# EAGLE design arduino-shield-xyz-stepper-v3 (EAGLE 8.7.1)
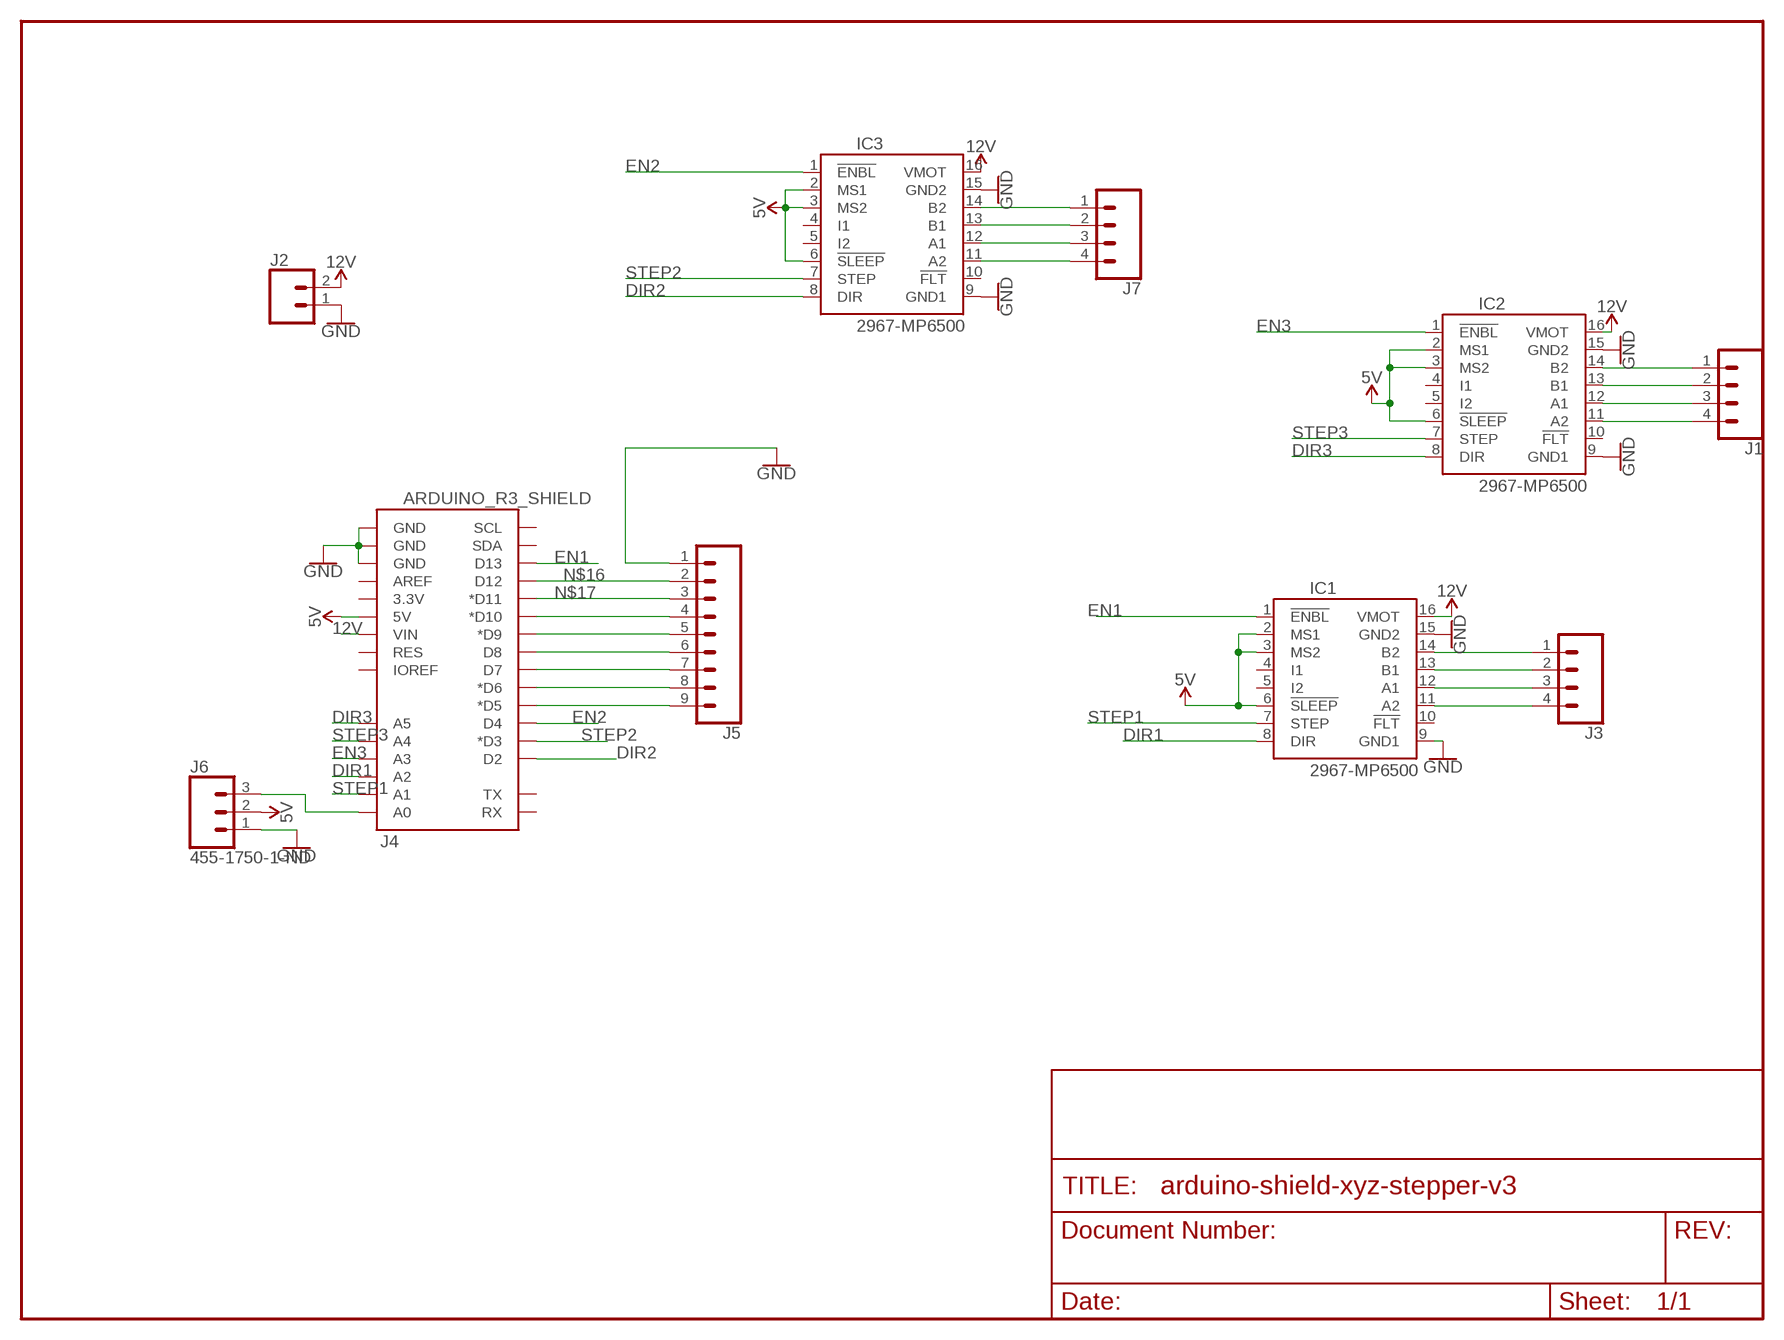
[diagram p0: schematic, sheet 1]

## Parts
IC1  2967-MP6500  [MP6500]
IC2  2967-MP6500  [MP6500]
IC3  2967-MP6500  [MP6500]
J1  CONN_04  [1X04]
J2  CONN_02  [1X02]
J3  CONN_04  [1X04]
J4  ARDUINO_R3_SHIELD  [UNO_R3_SHIELD]
J5  CONN_09  [1X09]
J6  455-1750-1-ND  CONN_03  [1X03]
J7  CONN_04  [1X04]

## Nets
5V: IC1.2(MS1) IC1.3(MS2) IC1.6(!SLEEP) IC2.2(MS1) IC2.3(MS2) IC2.6(!SLEEP) IC3.2(MS1) IC3.3(MS2) IC3.6(!SLEEP) J4.5V J6.2
12V: IC1.16(VMOT) IC2.16(VMOT) IC3.16(VMOT) J2.2 J4.VIN
DIR1: IC1.8(DIR) J4.A2
DIR2: IC3.8(DIR) J4.D2
DIR3: IC2.8(DIR) J4.A5
EN1: IC1.1(!ENBL) J4.D13
EN2: IC3.1(!ENBL) J4.D4
EN3: IC2.1(!ENBL) J4.A3
GND [vcc]: IC1.9(GND1) IC1.15(GND2) IC2.9(GND1) IC2.15(GND2) IC3.9(GND1) IC3.15(GND2) J2.1 J4.GND@0(GND) J4.GND@1(GND) J4.GND@2(GND) J5.1 J6.1
N$1: IC3.14(B2) J7.1
N$4: IC3.13(B1) J7.2
N$5: IC1.14(B2) J3.1
N$6: IC1.13(B1) J3.2
N$7: IC1.12(A1) J3.3
N$8: IC1.11(A2) J3.4
N$9: IC2.14(B2) J1.1
N$10: IC2.13(B1) J1.2
N$11: IC2.12(A1) J1.3
N$12: IC2.11(A2) J1.4
N$13: IC3.12(A1) J7.3
N$14: IC3.11(A2) J7.4
N$15: J4.A0 J6.3
N$16: J4.D12 J5.2
N$17: J4.D11(*D11) J5.3
N$18: J4.D10(*D10) J5.4
N$19: J4.D9(*D9) J5.5
N$22: J4.D8 J5.6
N$23: J4.D7 J5.7
N$24: J4.D6(*D6) J5.8
N$25: J4.D5(*D5) J5.9
STEP1: IC1.7(STEP) J4.A1
STEP2: IC3.7(STEP) J4.D3(*D3)
STEP3: IC2.7(STEP) J4.A4
Unconnected: IC1.4(I1) IC1.5(I2) IC1.10(!FLT) IC2.4(I1) IC2.5(I2) IC2.10(!FLT) IC3.4(I1) IC3.5(I2) IC3.10(!FLT) J4.3.3V J4.AREF J4.IOREF J4.RES J4.RX J4.SCL J4.SDA J4.TX

## Library data of the parts
IC1-IC3 = pololu-stepper-driver:2967-MP6500: MP6500 Stepper Motor Driver Carrier; Potentiometer Current Control (Header Pins Soldered) #2967 MP6500 Stepper Motor Driver Carrier; Potentiometer Current Control (Header Pins Soldered) <https://www.pololu.com/product/2967> in Japan, Suzaku Lab. Ltd. <https://suzakugiken.jp/> #2967 MP6500ステッピングモータドライバボード ポテンショメータ式電流制御 (ヘッダーピン実装済み) <https://szc.jp/po2967>
J1 J3 J7 = SparkFun-Connectors:CONN_04: Multi connection point. Often used as Generic Header-pin footprint for 0.1 inch spaced/style header connections On any of the 0.1 inch spaced packages, you can populate with these: Break Away Headers - Straight <https://www.sparkfun.com/products/116> (PRT-00116) Break Away Male Headers - Right Angle <https://www.sparkfun.com/products/553> (PRT-00553) Female Headers <https://www.sparkfun.com/products/115> (PRT-00115) Break Away Headers - Machine Pin <https://www.sparkfun.com/products/117> (PRT-00117) Break Away Female Headers - Swiss Machine Pin <https://www.sparkfun.com/products/743> (PRT-00743) For SCREWTERMINALS and SPRING TERMINALS visit here: Screw Terimnals on SparkFun.com <https://www.sparkfun.com/search/results?term=Screw+Terminals> (5mm/3.5mm/2.54mm spacing) This device is also useful as a general connection point to wire up your design to another part of your project. Our various solder wires solder well into these plated through hole pads. Hook-Up Wire - Assortment (Stranded, 22 AWG) <https://www.sparkfun.com/products/11375> (PRT-11375) Hook-Up Wire - Assortment (Solid Core, 22 AWG) <https://www.sparkfun.com/products/11367> (PRT-11367) View the entire wire category on our website here <https://www.sparkfun.com/categories/141> Special notes: Molex polarized connector foot print use with SKU : PRT-08231 with associated crimp pins and housings. 1MM SMD Version SKU: PRT-10208; PROD_ID: CONN-09696
J2 = SparkFun-Connectors:CONN_02: Multi connection point. Often used as Generic Header-pin footprint for 0.1 inch spaced/style header connections On any of the 0.1 inch spaced packages, you can populate with these: Break Away Headers - Straight <https://www.sparkfun.com/products/116> (PRT-00116) Break Away Male Headers - Right Angle <https://www.sparkfun.com/products/553> (PRT-00553) Female Headers <https://www.sparkfun.com/products/115> (PRT-00115) Break Away Headers - Machine Pin <https://www.sparkfun.com/products/117> (PRT-00117) Break Away Female Headers - Swiss Machine Pin <https://www.sparkfun.com/products/743> (PRT-00743) For SCREWTERMINALS and SPRING TERMINALS visit here: Screw Terimnals on SparkFun.com <https://www.sparkfun.com/search/results?term=Screw+Terminals> (5mm/3.5mm/2.54mm spacing) This device is also useful as a general connection point to wire up your design to another part of your project. Our various solder wires solder well into these plated through hole pads. Hook-Up Wire - Assortment (Stranded, 22 AWG) <https://www.sparkfun.com/products/11375> (PRT-11375) Hook-Up Wire - Assortment (Solid Core, 22 AWG) <https://www.sparkfun.com/products/11367> (PRT-11367) View the entire wire category on our website here <https://www.sparkfun.com/categories/141> Special notes: Molex polarized connector foot print use with: PRT-08233 with associated crimp pins and housings. 2.54_SCREWTERM for use with PRT-10571. 3.5mm Screw Terminal footprints for PRT-08084 5mm Screw Terminal footprints for use with PRT-08432
J4 = SparkFun-Boards:ARDUINO_R3_SHIELD: Shield form compatible with the Arduino Uno R3.
J5 = SparkFun-Connectors:CONN_09: Multi connection point. Often used as Generic Header-pin footprint for 0.1 inch spaced/style header connections On any of the 0.1 inch spaced packages, you can populate with these: Break Away Headers - Straight <https://www.sparkfun.com/products/116> (PRT-00116) Break Away Male Headers - Right Angle <https://www.sparkfun.com/products/553> (PRT-00553) Female Headers <https://www.sparkfun.com/products/115> (PRT-00115) Break Away Headers - Machine Pin <https://www.sparkfun.com/products/117> (PRT-00117) Break Away Female Headers - Swiss Machine Pin <https://www.sparkfun.com/products/743> (PRT-00743) For SCREWTERMINALS and SPRING TERMINALS visit here: Screw Terimnals on SparkFun.com <https://www.sparkfun.com/search/results?term=Screw+Terminals> (5mm/3.5mm/2.54mm spacing) This device is also useful as a general connection point to wire up your design to another part of your project. Our various solder wires solder well into these plated through hole pads. Hook-Up Wire - Assortment (Stranded, 22 AWG) <https://www.sparkfun.com/products/11375> (PRT-11375) Hook-Up Wire - Assortment (Solid Core, 22 AWG) <https://www.sparkfun.com/products/11367> (PRT-11367) View the entire wire category on our website here <https://www.sparkfun.com/categories/141> Special notes: Molex polarized connector foot print use with SKU : PRT-08231 with associated crimp pins and housings. 1MM SMD Version SKU: PRT-10208 NOTES ON THE VARIANTS LOCK and LOCK_LONGPADS... This footprint was designed to help hold the alignment of a through-hole component (i.e. 6-pin header) while soldering it into place. You may notice that each hole has been shifted either up or down by 0.005 of an inch from it's more standard position (which is a perfectly straight line). This slight alteration caused the pins (the squares in the middle) to touch the edges of the holes. Because they are alternating, it causes a "brace" to hold the component in place. 0.005 has proven to be the perfect amount of "off-center" position when using our standard breakaway headers. Although looks a little odd when you look at the bare footprint, once you have a header in there, the alteration is very hard to notice. Also,if you push a header all the way into place, it is covered up entirely on the bottom side.
J6 = SparkFun-Connectors:CONN_03: Multi connection point. Often used as Generic Header-pin footprint for 0.1 inch spaced/style header connections On any of the 0.1 inch spaced packages, you can populate with these: Break Away Headers - Straight <https://www.sparkfun.com/products/116> (PRT-00116) Break Away Male Headers - Right Angle <https://www.sparkfun.com/products/553> (PRT-00553) Female Headers <https://www.sparkfun.com/products/115> (PRT-00115) Break Away Headers - Machine Pin <https://www.sparkfun.com/products/117> (PRT-00117) Break Away Female Headers - Swiss Machine Pin <https://www.sparkfun.com/products/743> (PRT-00743) Stackable Header - 3 Pin (Female, 0.1") <https://www.sparkfun.com/products/13875> (PRT-13875) For SCREWTERMINALS and SPRING TERMINALS visit here: Screw Terimnals on SparkFun.com <https://www.sparkfun.com/search/results?term=Screw+Terminals> (5mm/3.5mm/2.54mm spacing) This device is also useful as a general connection point to wire up your design to another part of your project. Our various solder wires solder well into these plated through hole pads. Hook-Up Wire - Assortment (Stranded, 22 AWG) <https://www.sparkfun.com/products/11375> (PRT-11375) Hook-Up Wire - Assortment (Solid Core, 22 AWG) <https://www.sparkfun.com/products/11367> (PRT-11367) View the entire wire category on our website here <https://www.sparkfun.com/categories/141> Special notes: Molex polarized connector foot print use with SKU : PRT-08232 with associated crimp pins and housings.; PROD_ID: XXX-00000

## Net classes
0 Default: width 0.178 mm
1 vcc: width 0.178 mm

## Board
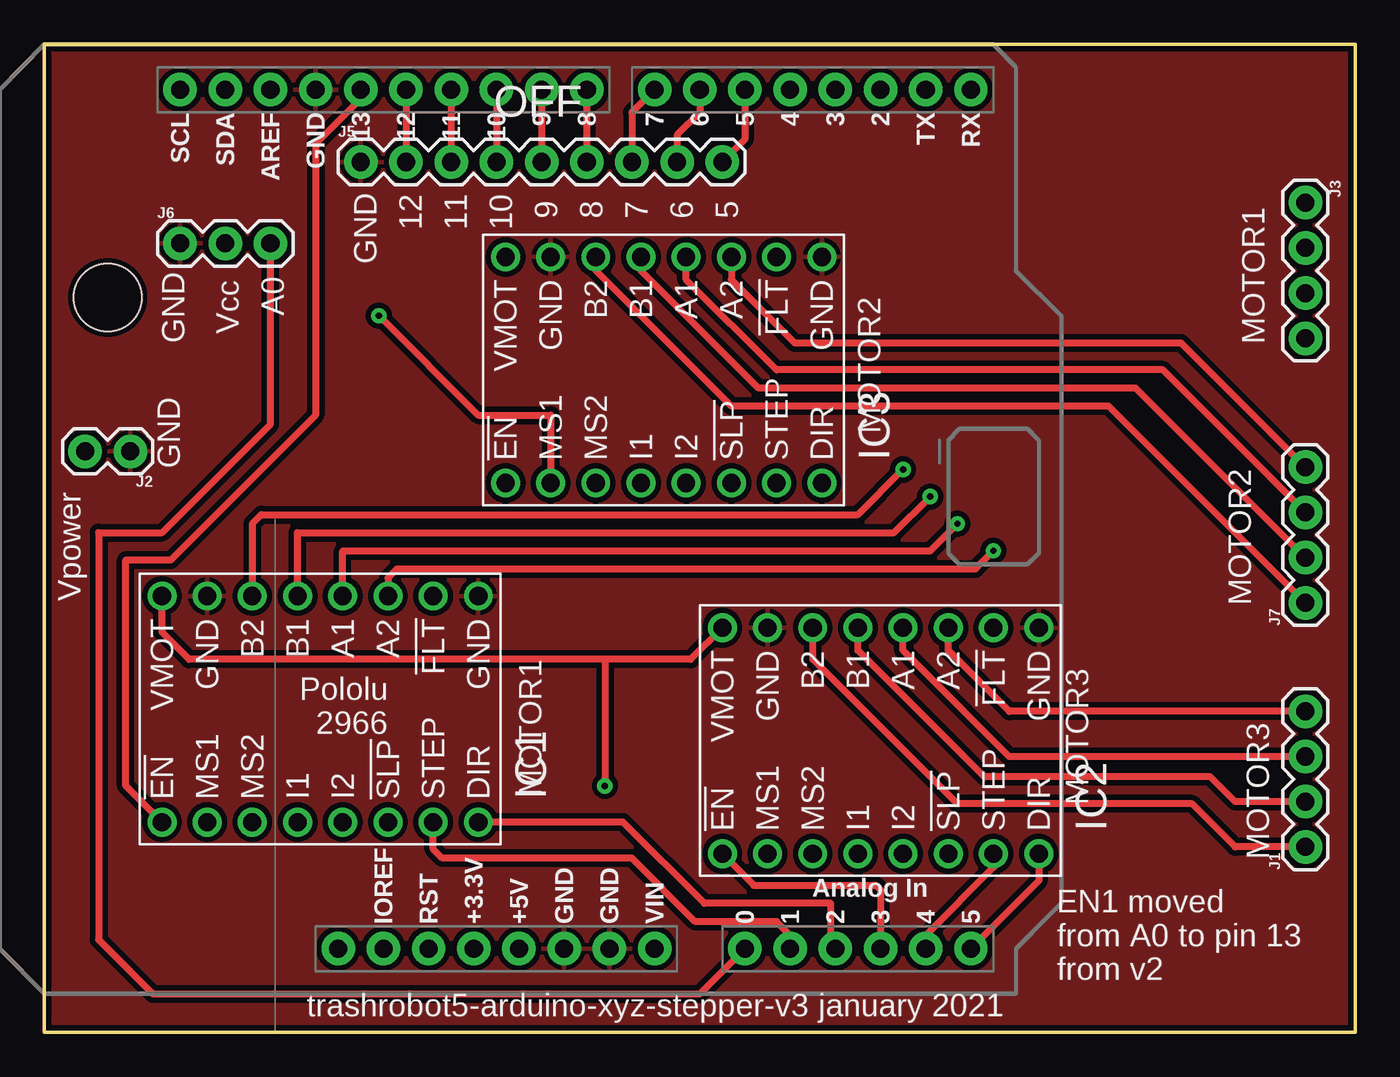
[diagram p1: board, top side]
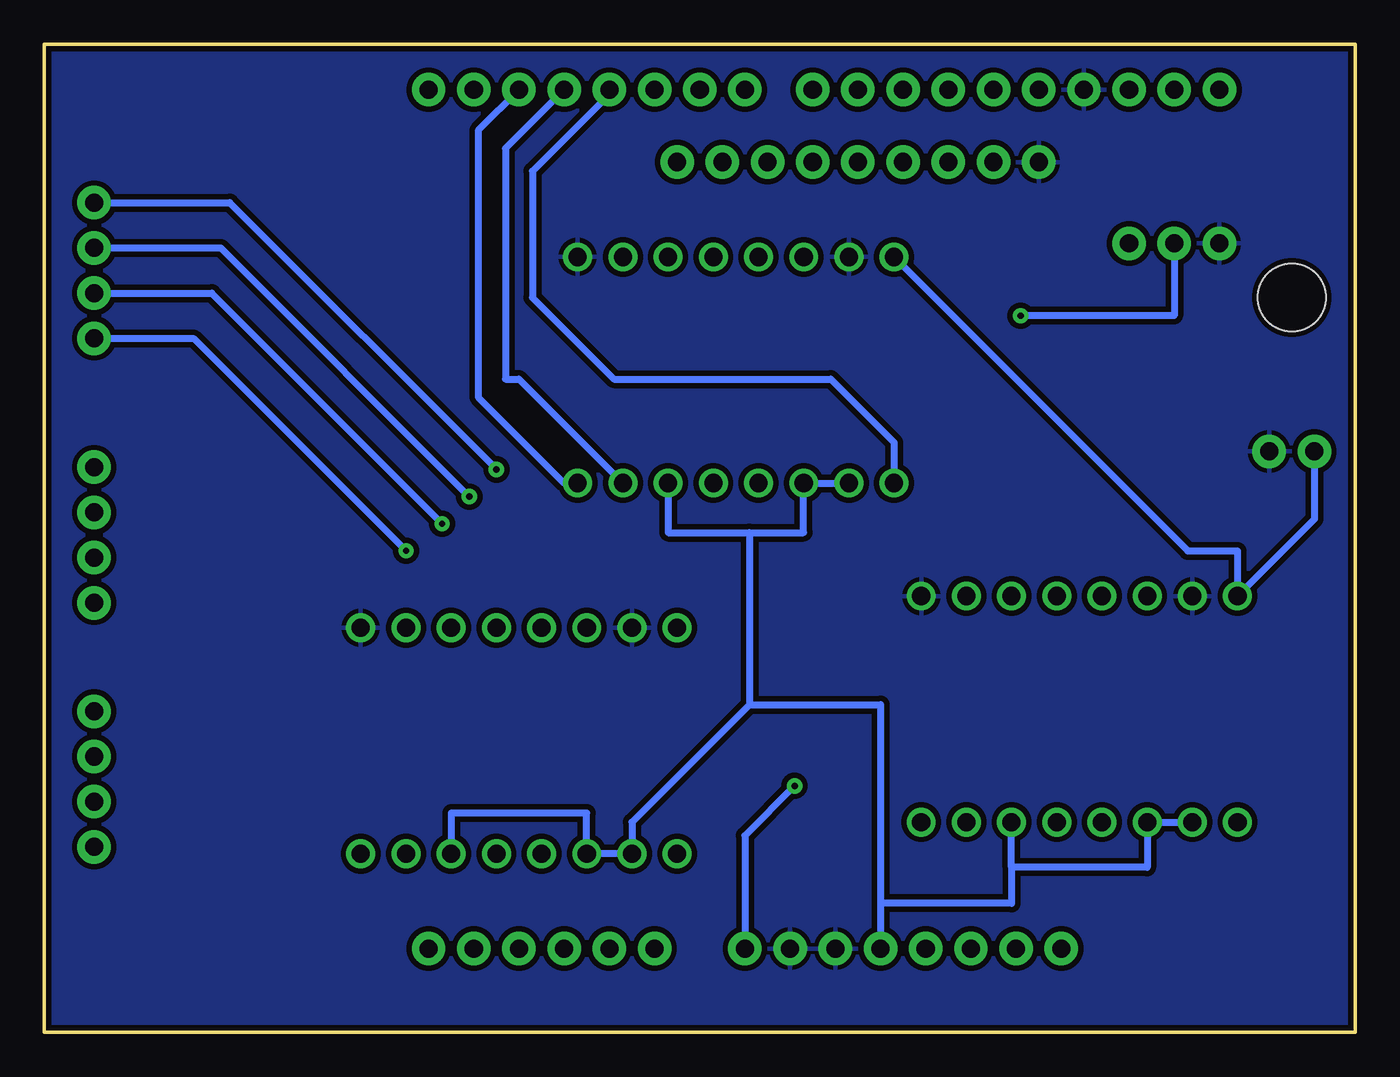
[diagram p2: board, bottom side, seen from below]

Size 73.66 x 55.5 mm. Coordinates in mm from the lower left corner, seen from the top.
Outline: 73.66,0 73.66,55.5 0,55.5 0,0 73.66,0
Copper layers (1*16): Top 0.035mm / dielectric 1.5mm / Bottom 0.035mm
Design rules "default": minimum track width 8mil, minimum drill 20mil, track to track 8mil, track to pad 8mil, pad to pad 8mil, via to via 8mil, smd to smd 8mil, copper to edge 10mil, drill to drill 8mil, minimum pad ring 12mil, minimum via ring 10mil, stop-mask expansion 4mil, vias tented up to drill 25mil, thermal gap 10mil
Holes 3.81 mm at 3.56,41.27

### Footprints (pad centres in the part's own frame; a part is rotated, then mirrored left to right if it is on the bottom)
MP6500 = drill 1.016: 1 -6.35,8.89; 2 -6.35,6.35; 3 -6.35,3.81; 4 -6.35,1.27; 5 -6.35,-1.27; 6 -6.35,-3.81; 7 -6.35,-6.35; 8 -6.35,-8.89; 9 6.35,-8.89; 10 6.35,-6.35; 11 6.35,-3.81; 12 6.35,-1.27; 13 6.35,1.27; 14 6.35,3.81; 15 6.35,6.35; 16 6.35,8.89
1X04 = drill 1.016 pad 1.88: 1 0,0; 2 2.54,0; 3 5.08,0; 4 7.62,0
1X02 = drill 1.016 pad 1.88: 1 0,0; 2 2.54,0
UNO_R3_SHIELD = drill 1.016 pad 1.88: 3.3V 50.8,26.67; 5V 50.8,29.21; A0 50.8,41.91; A1 50.8,44.45; A2 50.8,46.99; A3 50.8,49.53; A4 50.8,52.07; A5 50.8,54.61; AREF 2.54,15.24; D2 2.54,49.53; D3 2.54,46.99; D4 2.54,44.45; D5 2.54,41.91; D6 2.54,39.37; D7 2.54,36.83; D8 2.54,33.02; D9 2.54,30.48; D10 2.54,27.94; D11 2.54,25.4; D12 2.54,22.86; D13 2.54,20.32; GND@0 50.8,31.75; GND@1 50.8,34.29; GND@2 2.54,17.78; IOREF 50.8,21.59; NC 50.8,19.05; RES 50.8,24.13; RX 2.54,54.61; SCL 2.54,10.16; SDA 2.54,12.7; TX 2.54,52.07; VIN 50.8,36.83
1X09 = drill 1.016 pad 1.88: 1 0,0; 2 2.54,0; 3 5.08,0; 4 7.62,0; 5 10.16,0; 6 12.7,0; 7 15.24,0; 8 17.78,0; 9 20.32,0
1X03 = drill 1.016 pad 1.88: 1 0,0; 2 2.54,0; 3 5.08,0

### Placement (x,y rotation side)
IC1  15.49,18.16 90 top
IC2  46.99,16.38 90 top
IC3  34.8,37.21 90 top
J1  70.87,10.41 90 top
J2  4.83,32.64 180 top
J3  70.87,46.61 270 top
J4  -2.54,55.5 270 top
J5  17.78,48.9 0 top
J6  7.62,44.32 0 top
J7  70.87,24.13 90 top

### Tracks (layer width: path | path; a pad name or v marks a point on that pad's centre or on a via)
5V  (via drill 0.35)
  Top 0.406: v18.8,40.26 24.38,34.67 28.45,34.67 IC3.2
  Bottom 0.406: IC1.2 IC1.3 11.68,9.27 19.3,9.27 | IC3.6 38.61,28.07 34.04,28.07 | 34.04,28.07 30.99,28.07 IC3.3 IC3.2 | 34.04,28.07 34.04,18.41 | 34.04,18.41 40.64,11.81 IC2.2 IC2.3 43.18,12.32 50.8,12.32 IC2.6 | 19.3,9.27 IC1.6 | 19.3,9.27 19.3,7.24 26.67,7.24 | 26.67,7.24 J4.5V | 34.04,18.41 26.67,18.41 26.67,7.24 | J6.2 10.16,40.26 v18.8,40.26
12V  (via drill 0.35)
  Top 0.406: IC2.16 36.32,20.95 31.5,20.95 | 31.5,20.95 8.13,20.95 6.6,22.48 IC1.16 | 31.5,20.95 v31.5,13.84
  Bottom 0.406: v31.5,13.84 34.29,11.05 J4.VIN | J2.2 2.29,28.83 IC1.16 6.6,27.05 9.4,27.05 IC3.16
DIR1
  Top 0.406: J4.A2 44.2,4.95 44.2,7.24 37.08,7.24 32.51,11.81 IC1.8
DIR2
  Bottom 0.406: J4.D2 49.28,50.67 49.28,35.69 44.45,30.86 IC3.8
DIR3
  Top 0.406: IC2.8 55.88,8.51 J4.A5
EN1
  Top 0.406: J4.D13 17.78,52.45 15.24,49.91 15.24,34.67 7.11,26.54 4.57,26.54 4.57,13.84 IC1.1
EN2
  Bottom 0.406: J4.D4 41.91,52.7 46.23,48.39 46.23,41.27 41.66,36.7 29.46,36.7 25.91,33.15 IC3.1
EN3
  Top 0.406: IC2.1 39.88,8.25 46.74,8.25 46.99,8 J4.A3
GND
  pour Top (isolate 0.305): 74.93,-0.13 -2.79,-0.64 -2.79,55.75 74.42,55.75
  pour Bottom (isolate 0.305): 74.41,-0.38 -0.62,-0.38 -0.76,56.01 74.29,56.01
N$1
  Top 0.406: J7.1 59.82,35.18 38.61,35.18 30.99,42.8 IC3.14
N$4
  Top 0.406: J7.2 61.34,36.2 40.13,36.2 33.53,42.8 IC3.13
N$5  (via drill 0.35)
  Top 0.406: IC1.14 11.68,28.57 12.19,29.08 45.72,29.08 v48.26,31.62
  Bottom 0.406: J3.1 63.25,46.61 v48.26,31.62
N$6  (via drill 0.35)
  Top 0.406: IC1.13 14.22,28.07 47.75,28.07 v49.78,30.1
  Bottom 0.406: J3.2 63.75,44.07 v49.78,30.1
N$7  (via drill 0.35)
  Top 0.406: IC1.12 16.76,27.05 49.78,27.05 v51.31,28.57
  Bottom 0.406: J3.3 64.26,41.53 v51.31,28.57
N$8  (via drill 0.35)
  Top 0.406: IC1.11 19.3,25.53 19.81,26.04 52.32,26.04 v53.34,27.05
  Bottom 0.406: J3.4 65.28,38.99 v53.34,27.05
N$9
  Top 0.406: J1.1 66.93,10.41 64.52,12.83 51.31,12.83 43.18,20.95 IC2.14
N$10
  Top 0.406: J1.2 66.93,12.95 65.53,14.35 52.83,14.35 45.72,21.46 IC2.13
N$11
  Top 0.406: J1.3 54.23,15.49 48.26,21.46 IC2.12
N$12
  Top 0.406: J1.4 54.23,18.03 50.8,21.46 IC2.11
N$13
  Top 0.406: J7.3 62.87,37.21 41.15,37.21 36.07,42.29 IC3.12
N$14
  Top 0.406: IC3.11 38.61,42.29 42.16,38.73 63.88,38.73 J7.4
N$15
  Top 0.406: J4.A0 36.83,2.16 6.1,2.16 3.05,5.21 3.05,28.07 6.6,28.07 12.7,34.16 J6.3
N$16
  Top 0.406: J4.D12 J5.2
N$17
  Top 0.406: J4.D11 J5.3
N$18
  Top 0.406: J4.D10 J5.4
N$19
  Top 0.406: J4.D9 J5.5
N$22
  Top 0.406: J4.D8 J5.6
N$23
  Top 0.406: J4.D7 33.02,51.69 J5.7
N$24
  Top 0.406: J4.D6 36.83,51.69 35.56,50.42 J5.8
N$25
  Top 0.406: J4.D5 39.37,50.16 J5.9
STEP1
  Top 0.406: J4.A1 41.91,5.46 41.15,6.22 36.58,6.22 33.02,9.78 22.35,9.78 21.84,10.29 IC1.7
STEP2
  Bottom 0.406: J4.D3 47.75,49.66 47.75,36.7 46.99,36.7 IC3.7
STEP3
  Top 0.406: IC2.7 53.34,9.27 49.53,5.46 J4.A4

### Text on the board
tPlace: OFF | MOTOR1 | 9 | 8 | 7 | 6 | 5 | 12 | 11 | 10 | GND | A0 | Vcc | GND | GND | MOTOR2 | Vpower | MOTOR2 | MOTOR1 | MOTOR3 | Pololu / 2966 | MOTOR3 | EN1 moved / from A0 to pin 13 / from v2 | trashrobot5-arduino-xyz-stepper-v3 january 2021
tValues: Tent Vias! | Arduino Wee v1.3